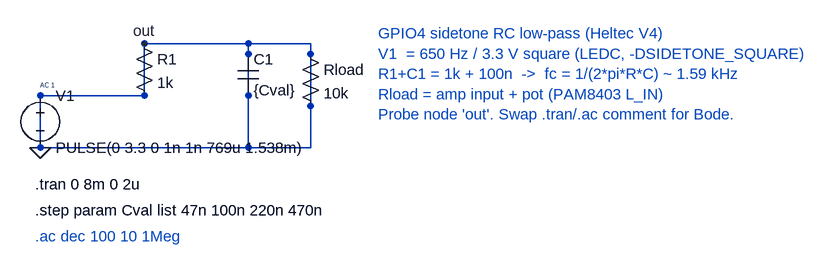
[diagram p0: schematic sidetone_rc_filter.asc]
sidetone_rc_filter.asc, the LTspice schematic file:
Version 4
SHEET 1 1056 680
WIRE 240 144 80 144
WIRE 240 64 240 144
WIRE 400 64 240 64
WIRE 496 64 400 64
WIRE 400 80 400 64
WIRE 496 80 496 64
WIRE 400 144 400 80
WIRE 496 160 496 80
WIRE 80 224 80 144
WIRE 400 224 400 144
WIRE 400 224 80 224
WIRE 496 224 496 160
WIRE 496 224 400 224
FLAG 80 224 0
FLAG 240 64 out
SYMBOL voltage 80 128 R0
WINDOW 123 0 0 Left 0
WINDOW 39 0 0 Left 0
SYMATTR InstName V1
SYMATTR Value PULSE(0 3.3 0 1n 1n 769u 1.538m)
SYMATTR Value2 AC 1
SYMBOL res 224 48 R0
SYMATTR InstName R1
SYMATTR Value 1k
SYMBOL cap 384 80 R0
SYMATTR InstName C1
SYMATTR Value {Cval}
SYMBOL res 480 64 R0
SYMATTR InstName Rload
SYMATTR Value 10k
TEXT 72 280 Left 2 !.tran 0 8m 0 2u
TEXT 72 320 Left 2 !.step param Cval list 47n 100n 220n 470n
TEXT 72 360 Left 2 ;.ac dec 100 10 1Meg
TEXT 600 48 Left 2 ;GPIO4 sidetone RC low-pass (Heltec V4)\nV1  = 650 Hz / 3.3 V square (LEDC, -DSIDETONE_SQUARE)\nR1+C1 = 1k + 100n  ->  fc = 1/(2*pi*R*C) ~ 1.59 kHz\nRload = amp input + pot (PAM8403 L_IN)\nProbe node 'out'. Swap .tran/.ac comment for Bode.

The netlist it stands for:
* sidetone_rc_filter.asc
V1 0 0 PULSE(0 3.3 0 1n 1n 769u 1.538m) AC 1
R1 0 0 1k
C1 0 0 {Cval}
Rload 0 0 10k
.tran 0 8m 0 2u
.step param Cval list 47n 100n 220n 470n
* .ac dec 100 10 1Meg
* GPIO4 sidetone RC low-pass (Heltec V4)
* V1  = 650 Hz / 3.3 V square (LEDC, -DSIDETONE_SQUARE)
* R1+C1 = 1k + 100n  ->  fc = 1/(2*pi*R*C) ~ 1.59 kHz
* Rload = amp input + pot (PAM8403 L_IN)
* Probe node 'out'. Swap .tran/.ac comment for Bode.
.backanno
.end